# Altium schematic sheet LOGIC.SchDoc
size Letter; SheetNumber: 5; SheetTotal: 5
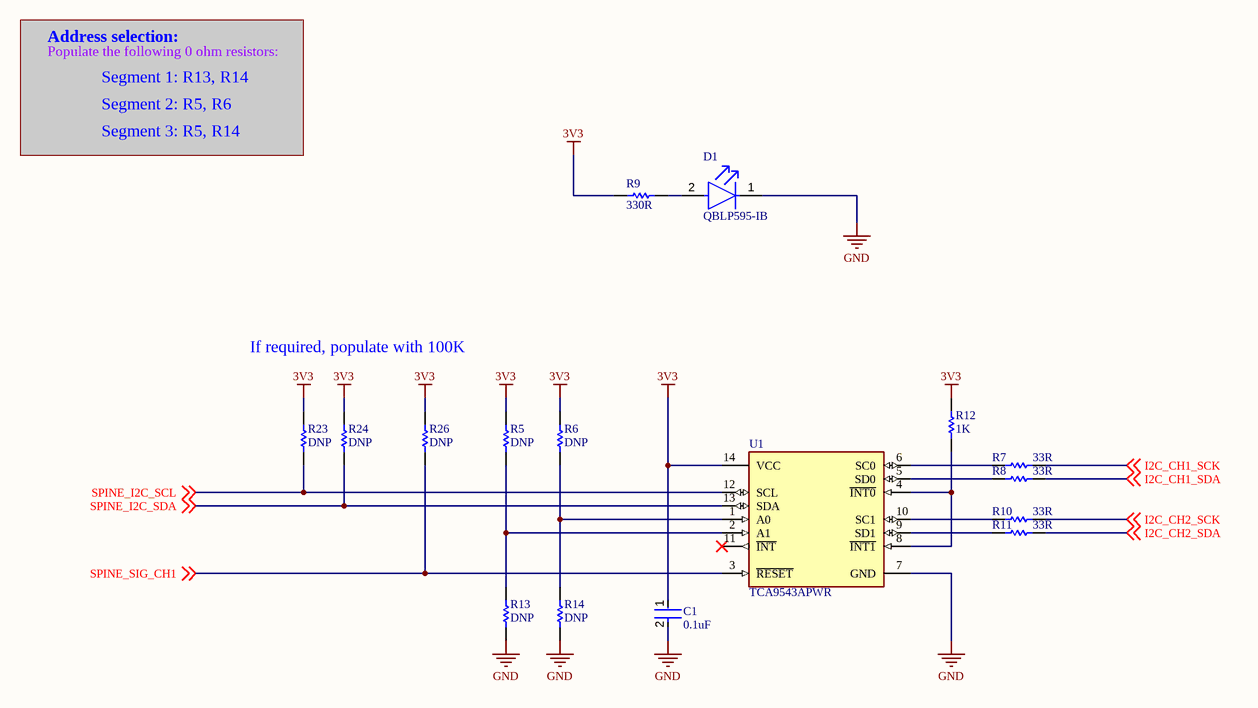
[diagram p0: LOGIC.SchDoc]

## Parts
C1  0.1uF  [FP-GRM15-MFG]
D1  QBLP595-IB  [FP-QBLP595-IB-MFG]
R5  DNP  [RESC1005X40X25NL05T10]
R6  DNP  [RESC1005X40X25NL05T10]
R7  33R  [RESC1005X40X25LL05T05]
R8  33R  [RESC1005X40X25LL05T05]
R9  330R  [RESC1005X40X25NL05T10]
R10  33R  [RESC1005X40X25LL05T05]
R11  33R  [RESC1005X40X25LL05T05]
R12  1K  [RESC1005X40X25LL05T10]
R13  DNP  [RESC1005X40X25NL05T10]
R14  DNP  [RESC1005X40X25NL05T10]
R23  DNP  [RESC1005X40X25ML10T10]
R24  DNP  [RESC1005X40X25ML10T10]
R26  DNP  [RESC1005X40X25ML10T10]
U1  TCA9543APWR  [FP-PW0014A-IPC_A]

## Nets
3V3: C1.1 R5.2 R6.2 R9.1 R12.2 R23.2 R24.2 R26.2 U1.14(VCC)
GND: C1.2 D1.1(C) R13.1 R14.1 U1.7(GND)
I2C_CH1_SCK: R7.2 ; off-sheet I2C_CH1_SCK
I2C_CH1_SDA: R8.2 ; off-sheet I2C_CH1_SDA
I2C_CH2_SCK: R10.2 ; off-sheet I2C_CH2_SCK
I2C_CH2_SDA: R11.2 ; off-sheet I2C_CH2_SDA
SPINE_I2C_SCL: R23.1 U1.12(SCL) ; off-sheet SPINE_I2C_SCL
SPINE_I2C_SDA: R24.1 U1.13(SDA) ; off-sheet SPINE_I2C_SDA
SPINE_SIG_CH1: R26.1 U1.3(~{RESET}) ; off-sheet SPINE_SIG_CH1
NetD1_2: D1.2(A) R9.2
NetR5_1: R5.1 R13.2 U1.2(A1)
NetR6_1: R6.1 R14.2 U1.1(A0)
NetR7_1: R7.1 U1.6(SC0)
NetR8_1: R8.1 U1.5(SD0)
NetR10_1: R10.1 U1.10(SC1)
NetR11_1: R11.1 U1.9(SD1)
NetR12_1: R12.1 U1.4(~{INT0}) U1.8(~{INT1})

Not connected (* = marked no-connect by the designer): U1 11(~{INT})*

## Notes on the sheet
- Address selection:
- Populate the following 0 ohm resistors:
- Segment 1: R13, R14
- Segment 2: R5, R6
- Segment 3: R5, R14
- If required, populate with 100K
- Title
- Copyright (c) Meta Platforms, Inc. and affiliates.
  All rights reserved.
  This source code is licensed under the license found in the
  LICENSE file in the root directory of this source tree.
- Sheet
- of

## Library data of the parts
C1 = CMP-2100-03641-2: CAP CER 0.1UF 16V X7R 0402; Manufacturer Part Number: GRM155R71C104KA88D; Manufacturer: Murata; Standoff Height: 0mm; Tolerance: 10%; Voltage Rating: 16Vdc; Material: Ceramic; Capacitance: 0.10μF; Value: 0.10μF; RoHS: TRUE; Temperature Characteristic: X7R; Octopart: https://octopart.com/grm155r71c104ka88d-murata-196880; Digikey Description: CAP CER 0.1UF 16V X7R 0402; Device Class L3: Ceramic Capacitors; Height: 0.55mm; ComponentLink2Description: Datasheet; Temperature Range Low: -55°C; Ipc Land Pattern Name: CAPC10050X219; ComponentLink2URL: https://search.murata.co.jp/Ceramy/image/img/A01X/G101/ENG/GRM155R71H471KA01-01A.pdf; Device Class L1: Passive Components; Lead Free: yes; Category: Cap; Package: GRM15; Temperature: -55°C to +125°C; Device Class L2: Capacitors; Temperature Range High: +125°C; Mouser Description: 0402 0.1 uF 16V ±10 % Tolerance X7R SMT Multilayer Ceramic Capacitor
D1 = CMP-113271-000002-1: LED BLUE CLEAR 0402 SMD; Lens Size: 0.5mm; Dominant Wavelength: 465nm; Forward Voltage: 3.1V; Lens Color: Colorless; Luminous Intensity: 85mcd; Test Current: 20mA; Viewing Angle: 140°; Lens Style: Flat; Width: 0.5mm; Case Code (Metric): 1005; Lens Transparency: Clear; Color: Blue; Packaging: Tape and Reel; Case Code (Imperial): 0402; Mount: Surface Mount; Length: 1mm; Case/Package: 0402; Height: 0.6mm
R5 R6 R13 R14 = CMP-1011-00001-2: Manufacturer: Yageo / Phycomp; Part Number: RC0402JR-070RL
R7 R8 R10 R11 = CMP-2002-01146-1: Manufacturer: Panasonic; Part Number: ERJ2RKF33R0X
R9 = CMP-2002-07985-1: Part Number: RC0402JR-07330RL; Manufacturer: Yageo / Phycomp
R12 = CMP-2002-07941-1: Part Number: RC0402JR-071KL; Manufacturer: Yageo / Phycomp
R23 R24 R26 = CMP-2002-05837-1: Part Number: ERA-2AED104X; Manufacturer: Panasonic
U1 = CMP-04892-000047-1: IC BUS SWITCH 2 X 1:2 14TSSOP; Max Supply Voltage: 5.5V; Propagation Delay: 1ns; Independent Circuits: 1; Min Supply Voltage: 1.65V; On-State Resistance: 16R; Supply Type: Single; High Level Output Current: 10uA; Packaging: Tape and Reel; RoHS Compliant: Yes; Case/Package: TSSOP; Weight: 0.002018oz; Number of Pins: 14; Max Operating Temperature: 85°C; Mount: Surface Mount; Lead Free: Lead Free; Min Operating Temperature: -40°C; Package Quantity: 2000